# EasyEDA Pro project STM32RC.eprj

# Schematic STM32RC
Board Name: STM32RC; Create Date: 2022-11-13; Page Name: Core; Project Name: STM32RC; Schematic Name: STM32RC; Update Date: 2025-09-01; Company: My Company; Page Size: A4; Version: V1.0
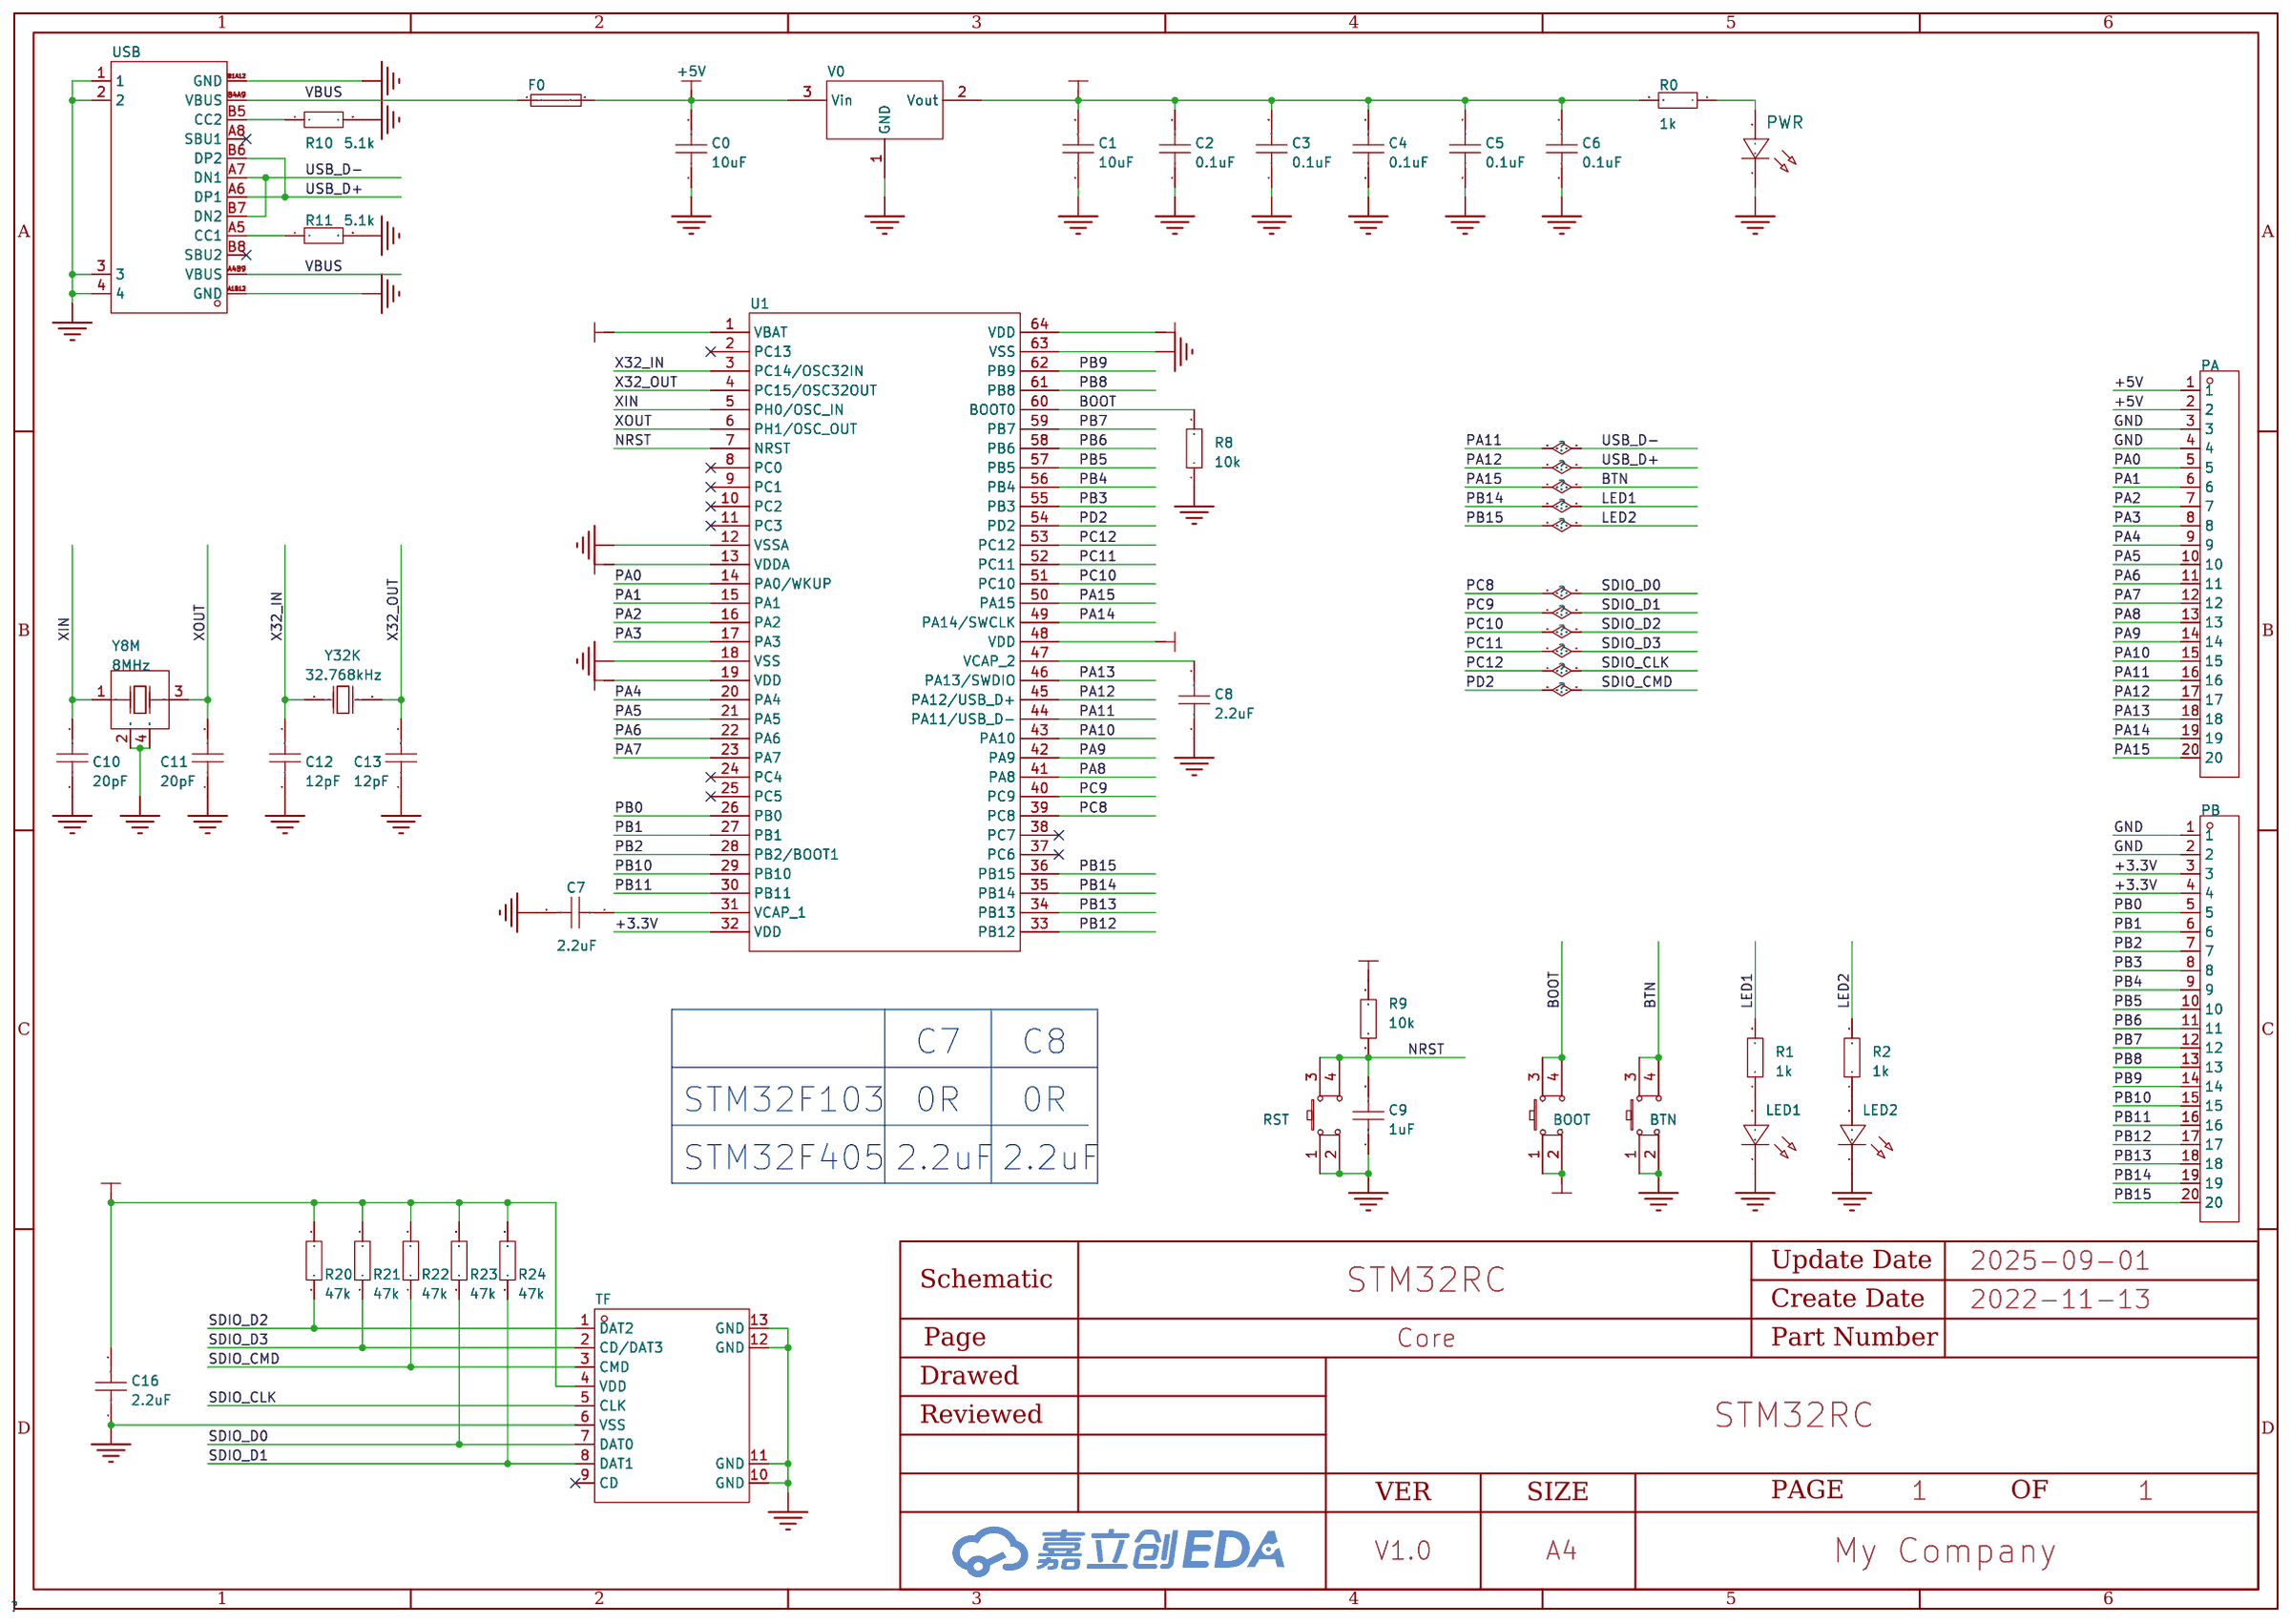
[diagram p0: schematic sheet]

## Parts
BOOT  PTS815SJK250SMTRLFS  [SW-SMD_4P-L4.2-W3.3-P2.15-LS5.1]
BTN  PTS815SJK250SMTRLFS  [SW-SMD_4P-L4.2-W3.3-P2.15-LS5.1]
C0  10uF  [C0603]
C1  10uF  [C0603]
C2  0.1uF  [C0603]
C3  0.1uF  [C0603]
C4  0.1uF  [C0603]
C5  0.1uF  [C0603]
C6  0.1uF  [C0603]
C7  2.2uF  [C0603]
C8  2.2uF  [C0603]
C9  1uF  [C0603]
C10  20pF  [C0603]
C11  20pF  [C0603]
C12  12pF  [C0603]
C13  12pF  [C0603]
C16  2.2uF  [C0603]
F0  JK-nSMD100-16  [F1206]
LED1  -  [LED0603-RD_BLUE]
LED2  -  [LED0603-RD_BLUE]
PA  -  [HDR-TH_20P-P2.54-V-M-1]
PB  -  [HDR-TH_20P-P2.54-V-M-1]
PWR  -  [LED0603-RD_BLUE]
R0  1k  [R0603]
R1  1k  [R0603]
R2  1k  [R0603]
R8  10k  [R0603]
R9  10k  [R0603]
R10  5.1k  [R0603]
R11  5.1k  [R0603]
R20  47k  [R0603]
R21  47k  [R0603]
R22  47k  [R0603]
R23  47k  [R0603]
R24  47k  [R0603]
RST  PTS815SJK250SMTRLFS  [SW-SMD_4P-L4.2-W3.3-P2.15-LS5.1]
TF  TF-01  [TF-SMD_TF-02]
U1  STM32F405RGT6  [LQFP-64_L10.0-W10.0-P0.50-LS12.0-BL]
USB  USB-TYPE-C-017  [USB-TYPE-C-SMD_C9900008089]
V0  AMS1117-3.3  [SOT-89-3_L4.5-W2.5-P1.50-LS4.2-BR]
Y8M  8MHz  [CRYSTAL-SMD_4P-L3.2-W2.5-BL]
Y32K  32.768kHz  [OSC-SMD_L3.2-W1.5]

## Library data of the parts
BOOT BTN RST = PTS815SJK250SMTRLFS: 操作寿命10万次，使用温度-20°C 至 70°C,尺寸4.20mmx3.20mmx2.50mm，操作力度2.5N; LCSC Part Name: 轻触开关; Supplier Part: C918859; Manufacturer: C&K; Supplier Footprint: SMD; JLCPCB Part Class: 扩展库; Datasheet: https://atta.szlcsc.com/upload/public/pdf/source/20190916/C411883_4F77F16E1D8E48DC707D8949CEE7CF80.pdf; Supplier: LCSC
C0-C13 C16 = CAP_0603: 容值:100nF;精度:±10%;额定电压:50V;温度系数:X7R;; Supplier Footprint: 0603
F0 = JK-nSMD100-16: LCSC Part Name: 16V 1A 1206自恢复; Supplier Part: C369161; Manufacturer: JK(金科); Supplier Footprint: 1206; JLCPCB Part Class: 扩展库; Datasheet: https://atta.szlcsc.com/upload/public/pdf/source/20190807/C409806_27B0F7EFFA3D5CEE60CCD1EE0A933E0A.pdf; Supplier: LCSC; Voltage - Max: 16V; Current - Max: 100A; Hold Current: 1A; Trip Current: 1.8A; Time to Trip(Max): 300ms
LED1 LED2 = LED_0603-B: 照明颜色:蓝色;主波长/色坐标:465~475nm;; Supplier Footprint: 0603; Supplier Part: C72041
PA PB = HDR-M_2.54_1x20P: 间距:2.54mm;总PIN位数:20;排数:1;插针结构:-;行距:-;安装类型:直插;圆针/方针:-;额定电流:-;额定电压:-;配合针长度:-;塑高:-;触头材质:黄铜;触头镀层:-;颜色:黑色;; Supplier Part: C50981; Supplier Footprint: 插件
PWR = LED_0603-R: 发光颜色:红灯;二极管配置:-;透镜颜色:无色透明;主波长:617.5nm;峰值波长:632nm;色温:-;光通量(25时):-;测试电流:5mA;正向电压(VF):2.2V;发光强度:28.5mcd;功率:60mW;发光角度:120°;安装方式:-;工作温度:-40~+85;; Supplier Footprint: 0603; Supplier Part: C72044
R0-R2 R8-R11 R20-R24 = Res_0603: Supplier Footprint: 0603
TF = TF-01: 卡连接方式:自弹式;卡类型:MicroSD卡(TF卡);连接器类型:卡座;本体最大高度:2mm;工作温度范围:-;; LCSC Part Name: 自弹式 MicroSD卡(TF卡) 卡座 9P外焊 端子镀金; Supplier Part: C2889257; Manufacturer: Yuandi(台湾元迪); Supplier Footprint: SMD; JLCPCB Part Class: 扩展库; Datasheet: https://atta.szlcsc.com/upload/public/pdf/source/20210830/04E8B8B371F2BAAE2FD01F5A99E06D9E.pdf; Supplier: LCSC; Card Connection Mode: 自弹式; Card Type: MicroSD卡(TF卡); Connector Type: 卡座; Maximum Body Height: 2mm
U1 = STM32F405RG: Supplier Part: C15742; Manufacturer: ST(意法半导体); Supplier Footprint: LQFP-64_10x10x05P; JLCPCB Part Class: Extended Part; Datasheet: https://atta.szlcsc.com/upload/public/pdf/source/20140724/1457707160365.pdf; Supplier: LCSC; Speed: 168MHz; Voltage - Supply (Vcc/Vdd): 1.8V ~ 3.6V; Program Memory Size: 1MB; RAM Size: 192KB; Number of I/O: 51; A/D: 16x12bit; D/A: 2x12bit; PWM: 56; LCD: MOTOROLA 6800 AND INTEL  8080 TYPE LCD DIRECTLY; UART/USART: 4 USART+2 UART; SPI: 3; I2C（SMBUS/PMBUS）: 3; USB Device: 1; USB Host/OTG: 1; CAN: 2
USB = USB-TYPE-C-017: 连接器类型:Type-C;标准:-;公母:母座;触点数量:16;端口数量:1;安装方式:卧贴;额定电流 - 电源:3A;工作温度范围:-25~+85;; Supplier Part: C2927037; Manufacturer: DEALON(德艺隆); Supplier Footprint: SMD; JLCPCB Part Class: 扩展库; Datasheet: https://atta.szlcsc.com/upload/public/pdf/source/20211217/653222EE5174722C9DFE2966329956D8.pdf; Supplier: LCSC; Connector Type: Type-C; Gender: 母座; Number of Contacts: 16; Number of Ports: 1; Mounting Style: 卧贴; Current Rating - Power (Max): 3A; Operating Temperature Range: -25~+85
V0 = AMS1117-3.3_SOT-89: 输出类型:-;; Supplier Part: C880752; Manufacturer: Slkor(萨科微); Supplier Footprint: SOT-89-3; JLCPCB Part Class: 扩展库; Datasheet: https://atta.szlcsc.com/upload/public/pdf/source/20201231/C426566_7F22DB93439D00F3FA27143E4F28C6AA.pdf; Supplier: LCSC
Y8M = X32258MSB4SI: 频率:8MHz;频率公差:±10ppm;负载电容:20pF;; LCSC Part Name: 8MHz ±10ppm 20pF YSX321SL; Supplier Part: C2682774; Manufacturer: YXC(扬兴晶振); Supplier Footprint: SMD3225-4P; JLCPCB Part Class: 扩展库; Datasheet: https://atta.szlcsc.com/upload/public/pdf/source/20210106/C2682774_0CD4FDA5D9DA3FBEEC23BD607A48E4B0.pdf; Supplier: LCSC; Crystal Type: 贴片无源晶振; Frequency Tolerance: ±10ppm; Frequency Stability: ±30ppm; Load Capacitance: 20pF; Operating Temperature: -40℃~+85℃
Y32K = 7LC32768F12UC: 工作温度:-40~+85;工作温度:-40~+85;频率:32.768kHz;负载电容:12.5pF;晶振类型:贴片无源晶振;频率公差:±20ppm;频率公差:±20ppm;等效串联电阻(ESR):70kΩ;; LCSC Part Name: 32.768KHZ 12.5PF  ±20ppm; Supplier Part: C252398; Manufacturer: SJK(晶科鑫); Supplier Footprint: SMD-3215_2P; JLCPCB Part Class: 扩展库; Datasheet: https://atta.szlcsc.com/upload/public/pdf/source/20180725/C252398_B09721EBC402D2F46F4FCA4EBDD60A31.pdf; Supplier: LCSC; Operating Temperature: -40~+85; Load Capacitance: 12.5pF; Crystal Type: 贴片无源晶振; Frequency Tolerance: ±20ppm; Equivalent Series Resistance (ESR): 70kΩ

## Nets
+3.3V: BOOT.1 BOOT.2 C1.2 C2.2 C3.2 C4.1 C5.1 C6.1 C16.2 PB.3 PB.4 R0.2 R9.2 R20.2 R21.2 R22.2 R23.2 R24.2 TF.4(VDD) U1.1(VBAT) U1.13(VDDA) U1.19(VDD) U1.32(VDD) U1.48(VDD) U1.64(VDD) V0.2(Vout)
+5V: C0.2 F0.2 PA.1 PA.2 V0.3(Vin)
GND: BTN.1 BTN.2 C0.1 C1.1 C2.1 C3.1 C4.2 C5.2 C6.2 C7.2 C8.1 C9.1 C10.2 C11.1 C12.2 C13.1 C16.1 LED1.1(C) LED2.1(C) PA.3 PA.4 PB.1 PB.2 PWR.1(C) R8.1 R10.2 R11.2 RST.1 RST.2 TF.6(VSS) TF.10(GND) TF.11(GND) TF.12(GND) TF.13(GND) U1.12(VSSA) U1.18(VSS) U1.63(VSS) USB.1 USB.2 USB.3 USB.4 USB.A1B12(GND) USB.B1A12(GND) V0.1(GND) Y8M.2(GND) Y8M.4(GND)
VBUS: F0.1 USB.A4B9(VBUS) USB.B4A9(VBUS)
BOOT: BOOT.3 BOOT.4 R8.2 U1.60(BOOT0)
BTN: BTN.3 BTN.4 PA.20 U1.50(PA15)
LED1: PB.19 R1.2 U1.35(PB14)
LED2: PB.20 R2.2 U1.36(PB15)
NRST: C9.2 R9.1 RST.3 RST.4 U1.7(NRST)
PA0: PA.5 U1.14(PA0/WKUP)
PA1: PA.6 U1.15(PA1)
PA2: PA.7 U1.16(PA2)
PA3: PA.8 U1.17(PA3)
PA4: PA.9 U1.20(PA4)
PA5: PA.10 U1.21(PA5)
PA6: PA.11 U1.22(PA6)
PA7: PA.12 U1.23(PA7)
PA8: PA.13 U1.41(PA8)
PA9: PA.14 U1.42(PA9)
PA10: PA.15 U1.43(PA10)
PA11: PA.16 U1.44(PA11/USB_D-) USB.A7(DN1) USB.B7(DN2)
PA12: PA.17 U1.45(PA12/USB_D+) USB.A6(DP1) USB.B6(DP2)
PA13: PA.18 U1.46(PA13/SWDIO)
PA14: PA.19 U1.49(PA14/SWCLK)
PB0: PB.5 U1.26(PB0)
PB1: PB.6 U1.27(PB1)
PB2: PB.7 U1.28(PB2/BOOT1)
PB3: PB.8 U1.55(PB3)
PB4: PB.9 U1.56(PB4)
PB5: PB.10 U1.57(PB5)
PB6: PB.11 U1.58(PB6)
PB7: PB.12 U1.59(PB7)
PB8: PB.13 U1.61(PB8)
PB9: PB.14 U1.62(PB9)
PB10: PB.15 U1.29(PB10)
PB11: PB.16 U1.30(PB11)
PB12: PB.17 U1.33(PB12)
PB13: PB.18 U1.34(PB13)
PC8: R23.1 TF.7(DAT0) U1.39(PC8)
PC9: R24.1 TF.8(DAT1) U1.40(PC9)
PC10: R20.1 TF.1(DAT2) U1.51(PC10)
PC11: R21.1 TF.2(CD/DAT3) U1.52(PC11)
PC12: TF.5(CLK) U1.53(PC12)
PD2: R22.1 TF.3(CMD) U1.54(PD2)
X32_IN: C12.1 U1.3(PC14/OSC32IN) Y32K.1(OSC1)
X32_OUT: C13.2 U1.4(PC15/OSC32OUT) Y32K.2(OSC2)
XIN: C10.1 U1.5(PH0/OSC_IN) Y8M.1(OSC1)
XOUT: C11.2 U1.6(PH1/OSC_OUT) Y8M.3(OSC2)
$1N6020: R11.1 USB.A5(CC1)
$1N6021: R10.1 USB.B5(CC2)
$1N6031: PWR.2(A) R0.1
$1N6077: C7.1 U1.31(VCAP_1)
$1N6095: C8.2 U1.47(VCAP_2)
$1N6193: LED1.2(A) R1.1
$1N6196: LED2.2(A) R2.1

Not connected (* = marked no-connect by the designer): TF 9(CD)*; U1 2(PC13)* 8(PC0)* 9(PC1)* 10(PC2)* 11(PC3)* 24(PC4)* 25(PC5)* 37(PC6)* 38(PC7)*; USB A8(SBU1)* B8(SBU2)*

## Notes on the sheet
- C7
- C8
- STM32F103
- 0R
- 0R
- STM32F405
- 2.2uF
- 2.2uF

# Board STM32RC
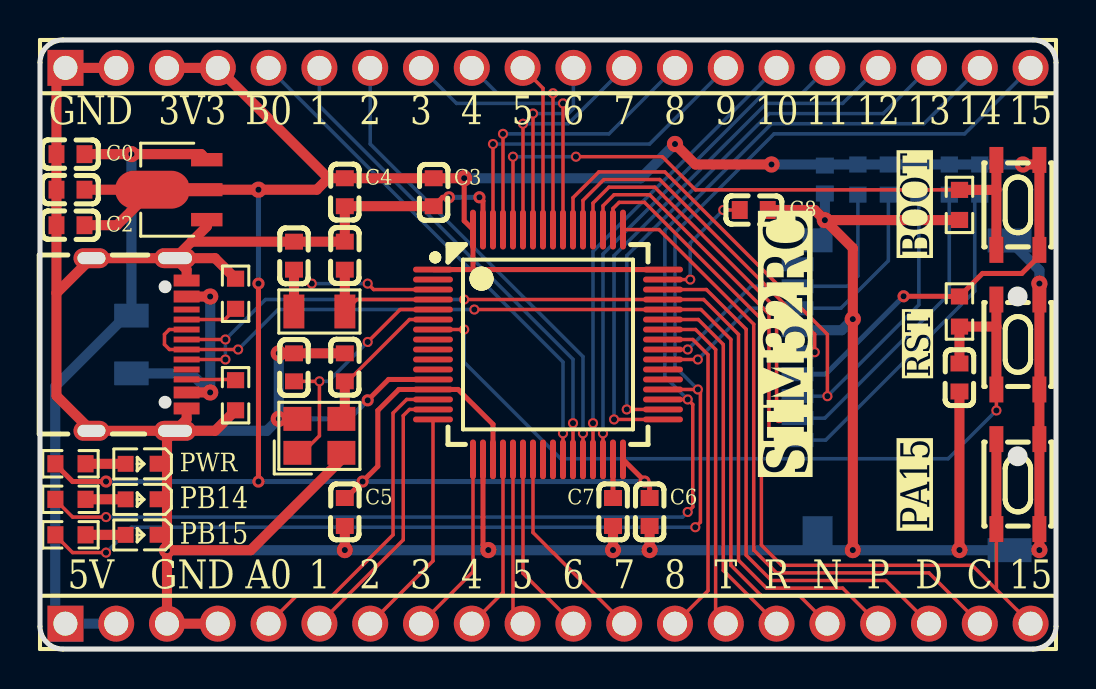
[diagram p1: board, top side]
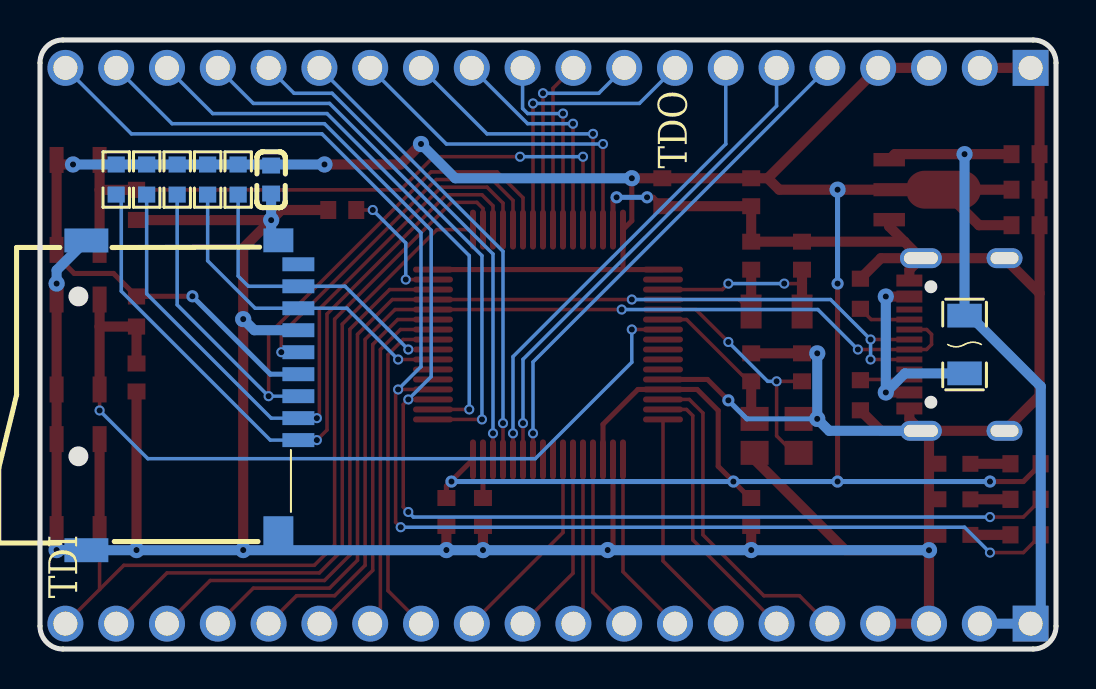
[diagram p2: board, bottom side, seen from below]

Outline 50.8 x 30.48 mm; copper layers: Top Layer, Bottom Layer. Coordinates in mm from the lower left corner of the outline.
Outline path: 0,29.34 0,1.14 arc(0.33,0.33) 1.14,0 49.66,0 arc(50.47,0.33) 50.8,1.14 50.8,29.34 arc(50.47,30.15) 49.66,30.48 1.14,30.48 arc(0.33,30.15) 0,29.34
Stack: Top Layer 0.035mm / Dielectric1 1.51mm FR4 er 4.5 / Bottom Layer 0.035mm

## Design rules (mm)
spacing safeClearance (default): track to track 0.152, other pairs 0.152 to 0.3
track width trackWidth (default): min 0.127, default 0.254, max 2.54
differential pair differentialPair (default): width min 0.127, default 0.254, max 2.54; gap min 0.152, default 0.152
via viaSize (default): diameter min 0.5, default 0.61, max 10; hole min 0.3, default 0.305, max 6

## Placement (name value [footprint] x y rotation side)
BOOT  PTS815SJK250SMTRLFS  [SW-SMD_4P-L4.2-W3.3-P2.15-LS5.1]  48.9 22.22 270 top
BTN  PTS815SJK250SMTRLFS  [SW-SMD_4P-L4.2-W3.3-P2.15-LS5.1]  48.9 8.25 270 top
C0  10uF  [C0603]  1.52 24.77 0 top
C1  10uF  [C0603]  1.52 22.99 0 top
C2  0.1uF  [C0603]  1.52 21.21 0 top
C3  0.1uF  [C0603]  19.69 22.86 90 top
C4  0.1uF  [C0603]  15.24 22.86 270 top
C5  0.1uF  [C0603]  15.24 6.86 270 top
C6  0.1uF  [C0603]  30.48 6.86 270 top
C7  2.2uF  [C0603]  28.65 6.86 270 top
C8  2.2uF  [C0603]  35.69 21.97 180 top
C9  1uF  [C0603]  45.97 13.59 90 top
C10  20pF  [C0603]  12.7 14.1 90 top
C11  20pF  [C0603]  15.24 14.1 270 top
C12  12pF  [C0603]  12.7 19.69 90 top
C13  12pF  [C0603]  15.24 19.69 270 top
C16  2.2uF  [C0603]  39.24 23.5 90 bottom
F0  JK-nSMD100-16  [F1206]  4.57 15.24 90 bottom
LED1  -  [LED0603-RD_BLUE]  5.08 7.49 180 top
LED2  -  [LED0603-RD_BLUE]  5.08 5.72 180 top
PA  -  [HDR-TH_20P-P2.54-V-M-1]  25.4 1.27 0 top
PB  -  [HDR-TH_20P-P2.54-V-M-1]  25.4 29.08 0 top
PWR  -  [LED0603-RD_BLUE]  5.08 9.27 180 top
R0  1k  [R0603]  1.52 9.27 180 top
R1  1k  [R0603]  1.52 7.49 180 top
R2  1k  [R0603]  1.52 5.72 180 top
R8  10k  [R0603]  45.97 22.22 90 top
R9  10k  [R0603]  45.97 16.89 90 top
R10  5.1k  [R0603]  9.78 12.7 270 top
R11  5.1k  [R0603]  9.78 17.78 90 top
R20  47k  [R0603]  46.99 23.5 90 bottom
R21  47k  [R0603]  45.47 23.5 90 bottom
R22  47k  [R0603]  43.94 23.5 90 bottom
R23  47k  [R0603]  42.42 23.5 90 bottom
R24  47k  [R0603]  40.89 23.5 90 bottom
RST  PTS815SJK250SMTRLFS  [SW-SMD_4P-L4.2-W3.3-P2.15-LS5.1]  48.9 15.24 270 top
TF  TF-01  [TF-SMD_TF-02]  43.18 12.7 270 bottom
U1  STM32F405RGT6  [LQFP-64_L10.0-W10.0-P0.50-LS12.0-BL]  25.4 15.24 270 top
USB  USB-TYPE-C-017  [USB-TYPE-C-SMD_C9900008089]  4.95 15.24 270 top
V0  AMS1117-3.3  [SOT-89-3_L4.5-W2.5-P1.50-LS4.2-BR]  6.98 22.99 0 top
Y8M  8MHz  [CRYSTAL-SMD_4P-L3.2-W2.5-BL]  13.97 10.67 0 top
Y32K  32.768kHz  [OSC-SMD_L3.2-W1.5]  13.97 16.89 0 top

## Footprints (pads in the part's own frame, mm; a bottom-side part is the same pattern mirrored in y, then rotated)
C0603
  rect 0.8x0.9 smd: 1(-0.7,0) 2(0.7,0)
CRYSTAL-SMD_4P-L3.2-W2.5-BL
  rect 1.4x1.2 smd: 1(-1.1,-0.85) 2(1.1,-0.85) 3(1.1,0.85) 4(-1.1,0.85)
F1206
  rect 1.19x1.728 smd: 1(-1.445,0) 2(1.445,0)
HDR-TH_20P-P2.54-V-M-1
  rect 1.801x1.801 hole 1.199: 1(-24.13,0)
  round 1.801 hole 1.199: 2(-21.59,0) 3(-19.05,0) 4(-16.51,0) 5(-13.97,0) 6(-11.43,0) 7(-8.89,0) 8(-6.35,0) 9(-3.81,0) 10(-1.27,0) 11(1.27,0) 12(3.81,0) 13(6.35,0) 14(8.89,0) 15(11.43,0) 16(13.97,0) 17(16.51,0) 18(19.05,0) 19(21.59,0) 20(24.13,0)
LED0603-RD_BLUE
  rect 0.8x0.8 smd: 1(-0.8,-0.003) 2(0.8,0.003)
LQFP-64_L10.0-W10.0-P0.50-LS12.0-BL
  oval 0.3x2 smd: 1(-3.75,-5.75) 2(-3.25,-5.75) 3(-2.75,-5.75) 4(-2.25,-5.75) 5(-1.75,-5.75) 6(-1.25,-5.75) 7(-0.75,-5.75) 8(-0.25,-5.75) 9(0.25,-5.75) 10(0.75,-5.75) 11(1.25,-5.75) 12(1.75,-5.75) 13(2.25,-5.75) 14(2.75,-5.75) 15(3.25,-5.75) 16(3.75,-5.75) 33(3.75,5.75) 34(3.25,5.75) 35(2.75,5.75) 36(2.25,5.75) 37(1.75,5.75) 38(1.25,5.75) 39(0.75,5.75) 40(0.25,5.75) 41(-0.25,5.75) 42(-0.75,5.75) 43(-1.25,5.75) 44(-1.75,5.75) 45(-2.25,5.75) 46(-2.75,5.75) 47(-3.25,5.75) 48(-3.75,5.75)
  oval 2x0.3 smd: 17(5.75,-3.75) 18(5.75,-3.25) 19(5.75,-2.75) 20(5.75,-2.25) 21(5.75,-1.75) 22(5.75,-1.25) 23(5.75,-0.75) 24(5.75,-0.25) 25(5.75,0.25) 26(5.75,0.75) 27(5.75,1.25) 28(5.75,1.75) 29(5.75,2.25) 30(5.75,2.75) 31(5.75,3.25) 32(5.75,3.75) 49(-5.75,3.75) 50(-5.75,3.25) 51(-5.75,2.75) 52(-5.75,2.25) 53(-5.75,1.75) 54(-5.75,1.25) 55(-5.75,0.75) 56(-5.75,0.25) 57(-5.75,-0.25) 58(-5.75,-0.75) 59(-5.75,-1.25) 60(-5.75,-1.75) 61(-5.75,-2.25) 62(-5.75,-2.75) 63(-5.75,-3.25) 64(-5.75,-3.75)
OSC-SMD_L3.2-W1.5
  rect 1.049x1.7 smd: 1(-1.275,0) 2(1.275,0)
R0603
  rect 0.806x0.864 smd: 1(-0.753,0) 2(0.753,0)
SOT-89-3_L4.5-W2.5-P1.50-LS4.2-BR
  rect 1.575x0.672 smd: 1(1.356,-1.5) 3(1.356,1.5)
  custom 5.377x1.9 smd: 2(-1.356,0)
SW-SMD_4P-L4.2-W3.3-P2.15-LS5.1
  rect 1.3x0.701 smd: 1(-2.251,1.075) 2(2.251,1.075) 3(-2.251,-1.075) 4(2.251,-1.075)
TF-SMD_TF-02
  rect 0.7x1.6 smd: 1(2.245,5.3) 2(1.145,5.3) 3(0.046,5.3) 4(-1.054,5.3) 5(-2.155,5.3) 6(-3.255,5.3) 7(-4.354,5.3) 8(-5.454,5.3) 9(-6.554,5.3)
  rect 1.2x1.5 smd: 10(-7.754,4.3)
  rect 1.2x2.2 smd: 11(-7.746,-5.3) 12(7.754,-5.3)
  rect 1.6x1.5 smd: 13(6.854,4.3)
USB-TYPE-C-SMD_C9900008089
  oval 1x2.1 hole 0.6x1.7: 1(-4.32,1.801) 2(4.32,1.801)
  oval 1x1.8 hole 0.6x1.4: 3(-4.32,-2.379) 4(4.32,-2.379)
  rect 0.6x1.3 smd: A1B12(-3.2,2.379) A4B9(-2.4,2.379) B1A12(3.2,2.379) B4A9(2.4,2.379)
  rect 0.3x1.3 smd: A5(-1.25,2.379) A6(-0.25,2.379) A7(0.25,2.379) A8(1.25,2.379) B5(1.75,2.379) B6(0.75,2.379) B7(-0.75,2.379) B8(-1.75,2.379)

## Nets
As in the schematic.

Pads without a net: TF 9; U1 2 8 9 10 11 24 25 37 38; USB A8 B8

## Via types
v1: diameter 0.61, hole 0.305, Top Layer to Bottom Layer, 9 vias
v2: diameter 0.813, hole 0.305, Top Layer to Bottom Layer, 21 vias
v3: diameter 0.508, hole 0.305, Top Layer to Bottom Layer, 40 vias

## Routing (per net, layer and track width the routed paths; a pad name or vN(x,y) marks a point on that pad's centre or on a via; arc(x,y) is an arc through that point)
+3.3V: length 160
  Top Layer w0.254: BOOT.2 49.97,19.67 49.09,18.8 47.13,18.8 R9.2 45.29,17.64 45.28,17.65 v1(43.18,17.65) ; R0.2 0.77,9.24 1.63,8.38 v1(3.3,8.38) ; C5.1 15.31,7.56 v1(16.13,8.38) 16.89,9.14 16.89,11.94 17.94,12.99 U1.13 20.9,12.99 22.65,11.24 U1.19 ; 21.65,18.99 U1.1 ; 21.65,18.99 U1.48 ; 21.65,18.99 U1.64 21.21,21.43 v2(21.21,23.56) ; U1.32 30.48,8.16 C6.1 ; v1(10.92,18.29) v1(10.92,8.38)
  Top Layer w0.508: BOOT.2 BOOT.1 49.74,24.25 v2(49.15,24.25) ; 14.41,23.56 C4.1 C3.2 v2(21.21,23.56) ; 14.41,23.56 13.84,22.99 v2(10.92,22.99) V0.2 ; 14.41,23.56 PB.4 PB.3 ; V0.2 3.85,21.21 C2.2 ; V0.2 C1.2 ; v2(36.58,24.25) 32.77,24.25 v2(31.75,25.27)
  Bottom Layer w0.254: v1(3.3,8.38) v1(10.92,8.38) v1(16.13,8.38) v1(30.23,8.38) ; TF.4 39.28,13.75 v1(43.18,17.65) ; v2(10.92,22.99) v1(10.92,18.29)
  Bottom Layer w0.508: v2(21.21,23.56) 30.04,23.56 v2(31.75,25.27) ; 49.15,24.25 v2(36.58,24.25)
+5V: length 34.2
  Top Layer w0.508: V0.3 8.06,24.77 v2(4.57,24.77) C0.2
  Bottom Layer w0.508: v2(4.57,24.77) F0.2 4.3,16.69 0.76,13.14 0.76,1.78 PA.1 PA.2
GND: length 215.8
  Top Layer w0.254: U1.63 22.15,22.43 v1(21.97,22.61) ; U1.12 17.43,13.49 v1(16.38,12.45) ; v2(22.42,4.95) 22.15,5.22 U1.18 ; v1(20.45,22.61) 20.13,22.61 C3.1
  Top Layer w0.508: v2(39.24,21.46) 45.97,21.46 R8.1 ; v2(39.24,21.46) 38.74,21.97 C8.1 ; v2(39.24,21.46) 40.64,20.07 v2(40.64,16.51) v2(40.64,4.95) ; v2(6.35,4.95) 6.35,10.52 USB.2 ; v2(6.35,4.95) PA.3 PA.4 ; v2(6.35,4.95) 10.53,4.95 15.07,9.48 Y8M.2 ; 7.58,20.39 C12.2 C13.1 C4.2 C3.1 ; 7.58,20.39 USB.1 ; 7.58,20.39 8.34,21.15 V0.1 ; USB.B1A12 7.33,11.5 USB.2 ; 0.82,17.81 0.82,12.67 USB.4 USB.2 ; 0.82,17.81 C2.1 C1.1 C0.1 0.82,28.64 PB.1 PB.2 ; 0.82,17.81 USB.3 USB.1 ; USB.A1B12 7.33,18.98 USB.1 ; USB.2 8.75,10.92 R10.2 ; USB.1 8.75,19.56 R11.2 ; v2(11.94,14.8) C10.2 C11.1 ; C9.1 v2(45.97,4.95) ; C5.2 v2(15.24,4.95) ; C6.2 v2(30.48,4.95) ; v2(49.97,18.29) RST.1 RST.2 BTN.1 BTN.2 v2(49.97,4.95) ; C7.2 v2(28.65,4.95) ; Y8M.4 v2(11.94,11.52)
  Bottom Layer w0.254: v1(21.97,22.61) v1(20.45,22.61) ; 22.35,4.95 22.36,4.95 ; v1(16.38,12.45) 15.46,11.52 v2(11.94,11.52)
  Bottom Layer w0.508: v2(30.48,4.95) 30.47,4.95 ; 30.47,4.95 40.65,4.95 ; 30.47,4.95 28.65,4.95 ; 40.65,4.95 45.97,4.95 ; 40.65,4.95 v2(40.64,4.95) ; 15.25,4.95 v2(6.35,4.95) ; 15.25,4.95 v2(15.24,4.95) ; 15.25,4.95 28.65,4.95 ; v2(49.97,4.95) 48.49,4.95 TF.12 45.97,4.95 ; USB.2 11.34,10.92 v2(11.94,11.52) v2(11.94,14.8) ; 45.97,4.95 v2(45.97,4.95) ; TF.10 39.24,20.82 v2(39.24,21.46) C16.1 ; v2(28.65,4.95) 28.65,4.95 ; TF.6 40.08,15.95 v2(40.64,16.51) ; v2(49.97,18.29) 49.97,18.96 TF.11
VBUS: length 11.5
  Top Layer w0.508: USB.B4A9 v2(8.51,12.84) ; USB.A4B9 v2(8.51,17.64)
  Bottom Layer w0.508: F0.1 7.55,13.8 v2(8.51,12.84) v2(8.51,17.64)
BOOT: length 33
  Top Layer w0.178: R8.2 32.77,22.98 31.12,24.64 v3(26.8,24.64) ; U1.60 v3(23.65,24.64)
  Top Layer w0.508: R8.2 47.82,22.98 ; 47.82,22.98 BOOT.3 ; 47.82,22.98 BOOT.4
  Bottom Layer w0.178: v3(23.65,24.64) v3(26.8,24.64)
BTN: length 44.9
  Top Layer w0.178: 47.82,2.98 PA.20 ; 47.82,2.98 BTN.4 ; 47.82,2.98 46.61,4.19 37.08,4.19 36.07,5.21 36.07,16.51 30.23,22.35 28.96,22.35 28.65,22.05 U1.50
  Top Layer w0.508: BTN.3 BTN.4
LED1: length 67.2
  Top Layer w0.178: U1.35 v3(32.38,12.49) 32.64,12.24 32.64,7.11 v3(32.38,6.86) ; R1.2 0.77,7.46 1.63,6.6 v3(3.3,6.6)
  Bottom Layer w0.178: v3(32.38,12.49) 31.24,13.63 31.24,20.95 36.58,26.29 44.2,26.29 PB.19 ; v3(32.38,6.86) 32.13,6.6 v3(3.3,6.6)
LED2: length 71.2
  Top Layer w0.178: v3(32.77,6.1) 33.02,6.35 33.02,12.86 v3(32.89,12.99) U1.36 ; R2.2 0.77,5.69 1.63,4.83 v3(3.3,4.83)
  Bottom Layer w0.178: v3(32.89,12.99) 31.75,14.13 31.75,20.83 36.7,25.78 46.23,25.78 PB.20 ; v3(3.3,4.83) 4.57,6.1 v3(32.77,6.1)
NRST: length 42.1
  Top Layer w0.178: U1.7 v3(21.21,15.99) ; RST.4 v3(47.82,11.94)
  Top Layer w0.508: C9.2 R9.1 47.82,16.14 ; 47.82,16.14 RST.3 ; 47.82,16.14 RST.4
  Bottom Layer w0.178: v3(47.82,11.94) 45.41,9.53 26.03,9.53 21.21,14.35 v3(21.21,15.99)
PA0: length 16.4
  Top Layer w0.178: PA.5 12.83,2.67 14.6,2.67 17.65,5.72 17.65,11.81 18.33,12.49 U1.14
PA1: length 13.8
  Top Layer w0.178: PA.6 18.16,5.46 18.16,11.68 18.47,11.99 U1.15
PA2: length 11.5
  Top Layer w0.178: PA.7 19.65,4.41 U1.16
PA3: length 9.3
  Top Layer w0.178: U1.17 21.65,3.87 PA.8
PA4: length 8.9
  Top Layer w0.178: U1.20 23.15,2.83 PA.9
PA5: length 8.4
  Top Layer w0.178: U1.21 23.65,1.75 PA.10
PA6: length 9.3
  Top Layer w0.178: U1.22 24.15,3.79 PA.11
PA7: length 10.1
  Top Layer w0.178: U1.23 24.65,5.83 PA.12
PA8: length 16.7
  Top Layer w0.178: U1.41 32.64,15.49 33.4,14.73 33.4,2.92 PA.13
PA9: length 17
  Top Layer w0.178: U1.42 32.78,15.99 33.78,14.99 33.78,1.78 PA.14
PA10: length 18.6
  Top Layer w0.178: PA.15 34.16,3.94 34.16,15.24 32.91,16.49 U1.43
PA11: length 48.9
  Top Layer w0.178: v3(9.91,14.99) USB.A7 6.47,14.99 6.22,15.24 6.22,15.75 6.47,15.99 USB.B7 ; v3(21.72,16.99) U1.44 33.05,16.99 34.54,15.49 34.54,4.19 36.07,2.67 37.97,2.67 PA.16
  Bottom Layer w0.178: v3(9.91,14.99) 11.91,16.99 v3(21.72,16.99)
PA12: length 51.7
  Top Layer w0.178: USB.A6 v3(9.27,15.49) ; USB.B6 v3(9.27,14.49) ; v3(21.21,17.49) U1.45 33.18,17.49 34.93,15.75 34.93,4.44 36.32,3.05 40.13,3.05 PA.17
  Bottom Layer w0.178: v3(21.21,17.49) 11.27,17.49 v3(9.27,15.49) v3(9.27,14.49)
PA13: length 26.8
  Top Layer w0.178: PA.18 42.29,3.43 36.58,3.43 35.31,4.7 35.31,16 33.32,17.99 U1.46
PA14: length 32.6
  Top Layer w0.178: U1.49 30.95,20.99 35.69,16.26 35.69,4.95 36.83,3.81 44.45,3.81 PA.19
PB0: length 25.7
  Top Layer w0.178: U1.26 v3(26.15,10.8)
  Bottom Layer w0.178: v3(26.15,10.8) 26.15,14.36 PB.5
PB1: length 24.8
  Top Layer w0.178: U1.27 v3(26.65,11.3)
  Bottom Layer w0.178: v3(26.65,11.3) 26.65,14.5 13.97,27.18 PB.6
PB2: length 24
  Top Layer w0.178: U1.28 v3(27.15,10.8)
  Bottom Layer w0.178: v3(27.15,10.8) 27.15,14.63 16.51,25.27 PB.7
PB3: length 14.2
  Top Layer w0.178: U1.55 v3(26.15,27.31)
  Bottom Layer w0.178: v3(26.15,27.31) 20.83,27.31 PB.8
PB4: length 11.4
  Top Layer w0.178: U1.56 v3(25.65,27.81)
  Bottom Layer w0.178: v3(25.65,27.81) 22.86,27.81 PB.9
PB5: length 8.5
  Top Layer w0.178: PB.10 25.15,28.06 U1.57
PB6: length 10
  Top Layer w0.178: U1.58 v3(24.65,26.8)
  Bottom Layer w0.178: v3(24.65,26.8) 26.42,26.8 26.67,27.05 PB.11
PB7: length 11.5
  Top Layer w0.178: U1.59 v3(24.15,26.29)
  Bottom Layer w0.178: v3(24.15,26.29) 26.42,26.29 PB.12
PB8: length 14.8
  Top Layer w0.178: U1.61 v3(23.15,25.78)
  Bottom Layer w0.178: PB.13 28.45,25.78 v3(23.15,25.78)
PB9: length 17.5
  Top Layer w0.178: U1.62 v3(22.65,25.27)
  Bottom Layer w0.178: PB.14 30.48,25.27 v3(22.65,25.27)
PB10: length 23.4
  Top Layer w0.178: U1.29 v3(27.65,11.3)
  Bottom Layer w0.178: PB.15 27.65,19.9 v3(27.65,11.3)
PB11: length 25.4
  Top Layer w0.178: U1.30 v3(28.15,10.8)
  Bottom Layer w0.178: v3(28.15,10.8) 28.15,19.77 36.19,27.81 38.1,27.81 PB.16
PB12: length 27.7
  Top Layer w0.178: U1.33 v3(28.7,11.49)
  Bottom Layer w0.178: v3(28.7,11.49) 28.7,19.69 36.32,27.31 40.13,27.31 PB.17
PB13: length 28.5
  Top Layer w0.178: U1.34 v3(29.34,11.99)
  Bottom Layer w0.178: PB.18 42.16,26.8 36.45,26.8 29.34,19.69 v3(29.34,11.99)
PC8: length 16.6
  Top Layer w0.178: U1.39 v3(32.89,14.49)
  Bottom Layer w0.178: v3(32.89,14.49) 35.46,17.05 TF.7 40.04,17.05 42.42,19.43 R23.1
PC9: length 15.3
  Top Layer w0.178: U1.40 v3(32.38,14.99)
  Bottom Layer w0.178: v3(32.38,14.99) 35.55,18.15 TF.8 40.38,18.15 40.89,18.67 R24.1
PC10: length 36.5
  Top Layer w0.178: v3(36.96,10.45) 36.45,10.96 36.45,16.76 30.48,22.73 28.7,22.73 28.15,22.18 U1.51
  Bottom Layer w0.178: v3(36.96,10.45) TF.1 39.28,10.45 46.74,17.91 46.74,22.49 R20.1
PC11: length 34.9
  Top Layer w0.178: U1.52 27.65,22.32 28.45,23.11 30.73,23.11 36.83,17.02 36.83,11.68 v3(36.96,11.55)
  Bottom Layer w0.178: v3(36.96,11.55) TF.2 39.24,11.55 45.47,17.78 R21.1
PC12: length 18.4
  Top Layer w0.178: U1.53 27.15,22.45 28.19,23.5 30.99,23.5 38.74,15.75 v3(38.74,14.85)
  Bottom Layer w0.178: TF.5 v3(38.74,14.85)
PD2: length 34.8
  Top Layer w0.178: U1.54 26.65,22.59 27.94,23.88 31.24,23.88 39.37,15.75 v3(39.37,12.65)
  Bottom Layer w0.178: R22.1 43.94,17.23 v3(39.37,12.65) TF.3
X32_IN: length 9.2
  Top Layer w0.178: v3(13.59,18.29) 12.7,18.29 ; U1.3 16.68,17.99 v3(16.38,18.29)
  Top Layer w0.508: Y32K.1 12.7,16.9 C12.1
  Bottom Layer w0.178: v3(16.38,18.29) v3(13.59,18.29)
X32_OUT: length 6.7
  Top Layer w0.178: U1.4 15.84,17.49 Y32K.2
  Top Layer w0.508: C13.2 15.24,16.9 Y32K.2
XIN: length 12.6
  Top Layer w0.178: C10.1 v3(13.97,13.4) 13.97,10.67 13.12,9.82 Y8M.1 ; U1.5 18.01,16.99 v3(16.38,15.37)
  Bottom Layer w0.178: v3(13.97,13.4) 14.41,13.4 v3(16.38,15.37)
XOUT: length 7.6
  Top Layer w0.178: U1.6 18.47,16.49 15.38,13.4 C11.2
  Top Layer w0.508: C11.2 15.24,11.69 Y8M.3
$1N6020: length 2.7
  Top Layer w0.178: USB.A5 9.24,16.49 R11.1
$1N6021: length 2.5
  Top Layer w0.178: R10.1 9.74,13.49 USB.B5
$1N6031: length 2
  Top Layer w0.508: R0.1 4.28,9.27 PWR.2
$1N6077: length 1.9
  Top Layer w0.254: 28.65,9.49 C7.1
$1N6095: length 6.4
  Top Layer w0.178: v3(34.16,21.97) C8.2 ; U1.47 v3(32.51,18.49)
  Bottom Layer w0.178: v3(34.16,21.97) 32.51,20.32 v3(32.51,18.49)
$1N6193: length 2
  Top Layer w0.508: R1.1 4.28,7.49 LED1.2
$1N6196: length 2
  Top Layer w0.508: LED2.2 4.28,5.72 R2.1

## Text on the board
Bottom Silkscreen Layer: TDI | TDO
Top Silkscreen Layer: PB14 | PB15 | GND | 3V3 | B0 | 1 | 2 | 3 | 4 | 5 | 6 | 7 | 8 | 9 | 10 | 11 | 12 | 13 | 14 | 15 | 5V | T | R | N | P | D | C | PA15 | A0 | BOOT | STM32RC
